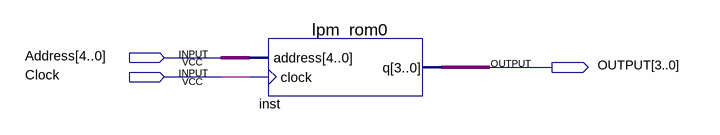
[diagram p0: schematic sheet]
// Quartus schematic lab10_1.bdf as structural Verilog: 1 symbols, 3 pins
module lab10_1 (
  input  [4:0] Address,
  input  Clock,
  output [3:0] OUTPUT
);

  lpm_rom0 inst (.address(Address), .clock(Clock), .q(OUTPUT));
endmodule
